# Altium schematic sheet TEENSY 2.SchDoc
size A; SheetNumber: 1; SheetTotal: 1
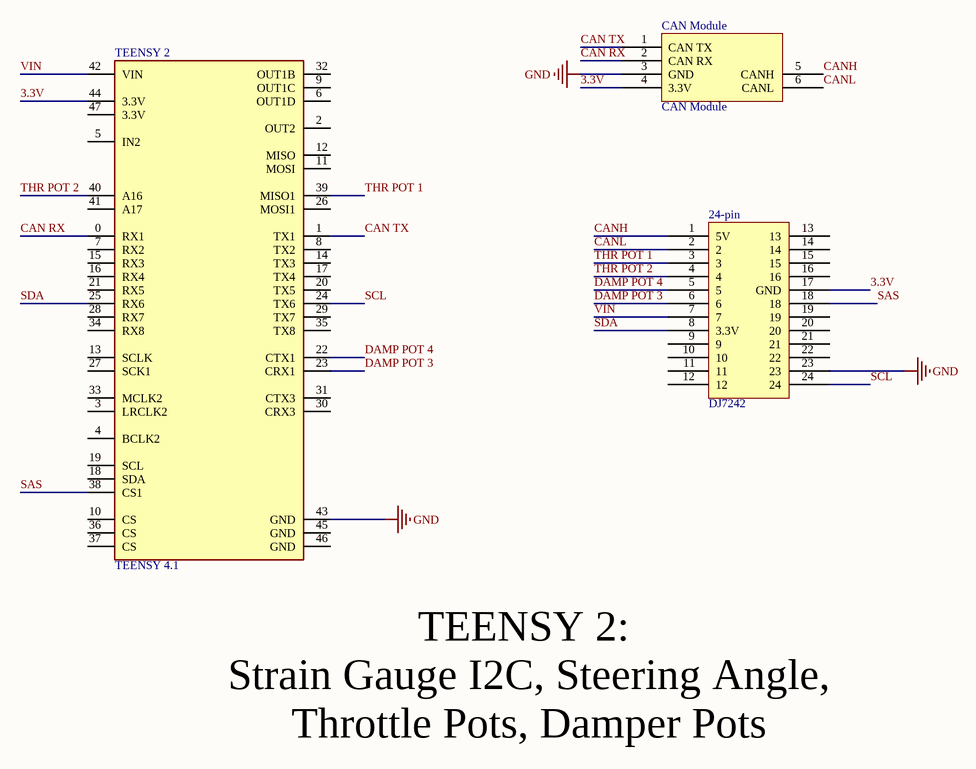
[diagram p0: TEENSY 2.SchDoc]

## Parts
24-pin  DJ7242  [DJ7242-Footprint-1]
CAN_Module  CAN Module  [CAN Module-Footprint-1]
TEENSY_2  TEENSY 4.1  [FP-DEV-16996-MFG]

## Nets
GND: 24-pin.23 CAN_Module.3(GND) TEENSY_2.43(GND)
3.3V: 24-pin.17(GND) CAN_Module.4(3.3V) TEENSY_2.44(3.3V)
CAN RX: CAN_Module.2(CAN_RX) TEENSY_2.0(RX1)
CAN TX: CAN_Module.1(CAN_TX) TEENSY_2.1(TX1)
CANH: 24-pin.1(5V) CAN_Module.5(CANH)
CANL: 24-pin.2 CAN_Module.6(CANL)
DAMP POT 3: 24-pin.6 TEENSY_2.23(CRX1)
DAMP POT 4: 24-pin.5 TEENSY_2.22(CTX1)
SAS: 24-pin.18 TEENSY_2.38(CS1)
SCL: 24-pin.24 TEENSY_2.24(TX6)
SDA: 24-pin.8(3.3V) TEENSY_2.25(RX6)
THR POT 1: 24-pin.3 TEENSY_2.39(MISO1)
THR POT 2: 24-pin.4 TEENSY_2.40(A16)
VIN: 24-pin.7 TEENSY_2.42(VIN)

Not connected (* = marked no-connect by the designer): 24-pin 9 10 11 12 13 14 15 16 19 20 21 22; TEENSY_2 2(OUT2) 3(LRCLK2) 4(BCLK2) 5(IN2) 6(OUT1D) 7(RX2) 8(TX2) 9(OUT1C) 10(CS) 11(MOSI) 12(MISO) 13(SCLK) 14(TX3) 15(RX3) 16(RX4) 17(TX4) 18(SDA) 19(SCL) 20(TX5) 21(RX5) 26(MOSI1) 27(SCK1) 28(RX7) 29(TX7) 30(CRX3) 31(CTX3) 32(OUT1B) 33(MCLK2) 34(RX8) 35(TX8) 36(CS) 37(CS) 41(A17) 45(GND) 46(GND) 47(3.3V)

## Notes on the sheet
- TEENSY 2:
  Strain Gauge I2C, Steering Angle,  Throttle Pots, Damper Pots

## Library data of the parts
24-pin = CMP-00030-00002-5: 24-pin connector
CAN_Module = CMP-00030-00003-1: CAN waveshare
TEENSY_2 = CMP-157412-000001-1: TEENSY 4.1 (HEADERS)